# EAGLE design ICS40300-Silicon-Mic_Rev-C (EAGLE 8.2.1)
COMPANY: ADAFRUIT INDUSTRIES; DRAWN: KTOWN; REV: A
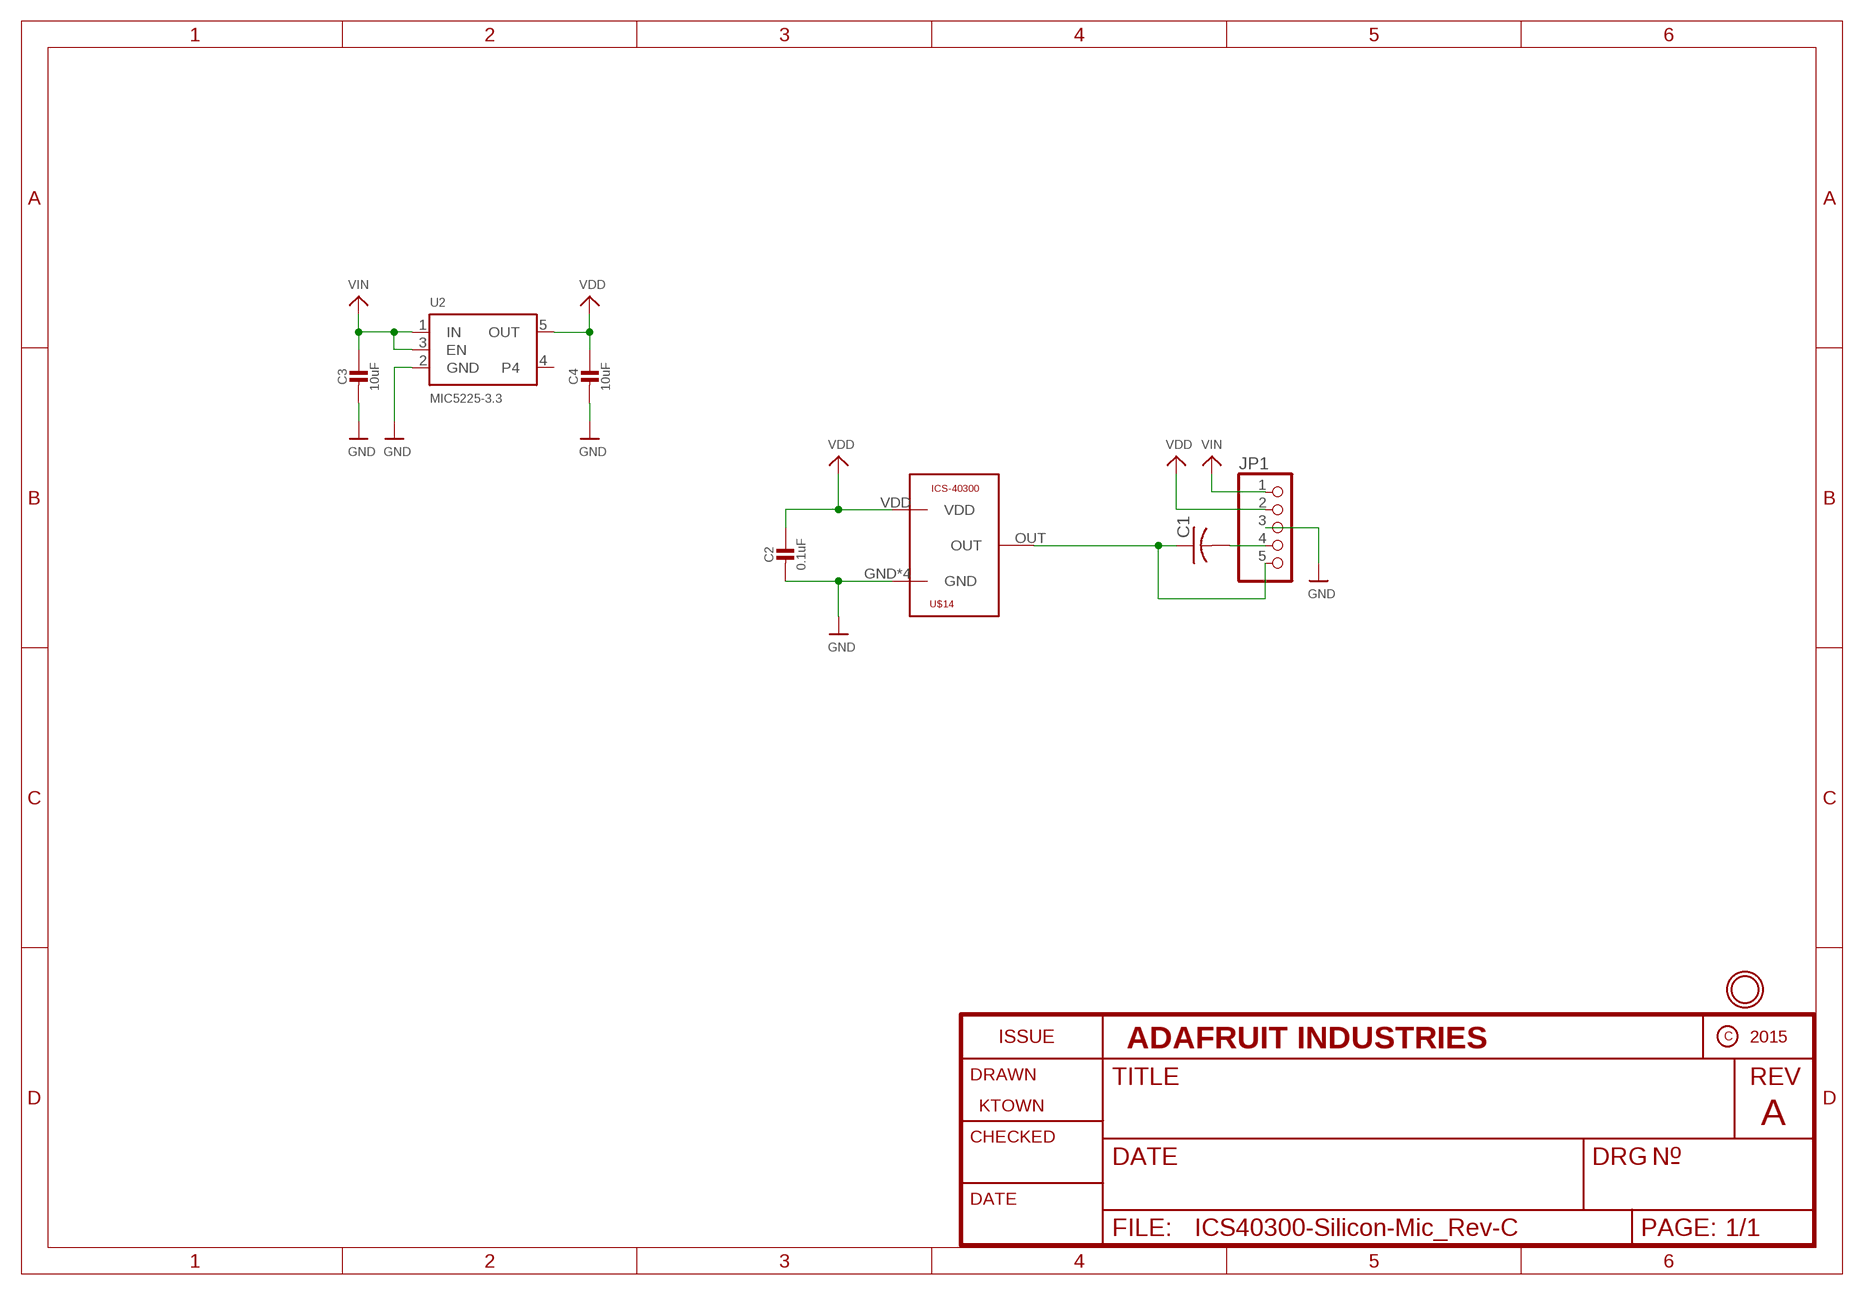
[diagram p0: schematic, sheet 1]

## Parts
C1  C-US  [CT7343]
C2  0.1uF  CAP_CERAMIC0805-NOOUTLINE  [0805-NO]
C3  10uF  CAP_CERAMIC0805-NOOUTLINE  [0805-NO]
C4  10uF  CAP_CERAMIC0805-NOOUTLINE  [0805-NO]
JP1  HEADER-1X576MIL  [1X05_ROUND_76]
U2  MIC5225-3.3  VREG_SOT23-5  [SOT23-5]
U$12  MOUNTINGHOLE2.5  [MOUNTINGHOLE_2.5_PLATED]
U$14  ICS-40300  [ICS-40300]

## Nets
GND: C2.2 C3.2 C4.2 JP1.3 U2.2(GND) U$14.GND U$14.GND1(GND) U$14.GND2(GND) U$14.GND3(GND)
N$1: C1.+ JP1.5 U$14.OUT
N$2: C1.- JP1.4
VDD: C2.1 C4.1 JP1.2 U2.5(OUT) U$14.VDD
VIN: C3.1 JP1.1 U2.1(IN) U2.3(EN)
Unconnected: U2.4

## Library data of the parts
C1 = adafruit:C-US: CAPACITOR, American symbol
C2-C4 = microbuilder:CAP_CERAMIC: Ceramic Capacitors For new designs, use the packages preceded by an '_' character since they are more reliable: The following footprints should be used on most boards: _0402 - Standard footprint for regular board layouts _0603 - Standard footprint for regular board layouts _0805 - Standard footprint for regular board layouts _1206 - Standard footprint for regular board layouts For extremely tight-pitch boards where space is at a premium, the following 'micro-pitch' footprints can be used (smaller pads, no silkscreen outline, etc.): _0402MP - Micro-pitch footprint for very dense/compact boards _0603MP - Micro-pitch footprint for very dense/compact boards _0805MP - Micro-pitch footprint for very dense/compact boards _1206MP - Micro-pitch footprint for very dense/compact boards
JP1 = microbuilder:HEADER-1X5: PIN HEADER
U2 = microbuilder:VREG_SOT23-5: SOT23-5 Fixed Voltage Regulators Part Current Out V Out V In V Dropout θJA (°C/W) TJ (°C) Digikey Part No. ADP121 150mA 3.3V 3.4-5.5V 0.09V @ 150mA -- -- ADP121-AUJZ33R7CT-ND ADP121 150mA 3.0V 3.1-5.5V 0.09V @ 150mA -- -- ADP121-AUJZ30R7CT-ND ADP122 300mA 3.3V 3.4-5.5V 0.085V @ 300mA -- -- ADP122AUJZ-3.3-R7CT-ND ADP1712 300mA 3.3V 3.5-5.5V 0.17V @ 300mA -- -- ADP1712AUJZ-3.3-R7TR-ND AP7311 (Low Cost) 150mA 3.3V 3.5-6V 0.15V @ 150mA -- -- AP7311-33WG-7DICT-ND LD39015M18R 150mA 1.8V 1.9V-5.5V 0.08V @ 100mA -- -- 497-6977-1-ND LP2985A-33DBVR 150mA 3.3V 3.3-16V 0.28V @ 150mA 206 150 296-18479-1-ND MCP1824T-3302E/OT 300mA 3.3V 3.5V-6V 0.2V @ 300mA -- -- MCP1824T-3302E/OTCT-ND MIC5205-2.5YM5 TR 150mA 2.5V 2.7-16V 0.165V @ 150mA -- -- 576-1257-2-ND MIC5205-3.0YM5 TR 150mA 3.0V 3.2V-16V 0.165V @ 150mA -- -- 576-1258-2-ND MIC5205-3.3YM5 TR 150mA 3.3V 3.5V-16V 0.165V @ 150mA -- -- 576-1259-2-ND TPS780330220 150mA 3.3V+2.2V 3.6-5.5V 250mV Max -- -- 296-23332-1-ND TDA3663/N1,135 100mA 3.3V 3.5-45V 0.18V @ 50mA -- -- 568-5343-1-ND Max operating temp can be calculated using θJA, TJ (max junction temperature), and power in watts. Set the "Maximum Ambient Temperature" until it reaches TJ ("Max Junction Temperature"), which is the absolute limit for safe use of the regulator: Heat Sink Temperature Calculator <http://www.daycounter.com/Calculators/Heat-Sink-Temperature-Calculator.phtml> For example, With 12V source into a 3.3V LP2985 and a 30mA load, we are dissipating (12V-3.3V) * 0.03A = 0.261W. With a θJA of 206 °C/W, a TJ of 150°C, and 261mW we can safely use the chip without a heat sink up to 75°C (=147.1°C Junction Temperature).
U$12 = microbuilder:MOUNTINGHOLE: Mounting Hole For #2 screws (0.086"/2.18mm width, 0.094"/2.4mm hole) use 2.5mm; BOM: EXCLUDE
U$14 = CMU-ArtFab:ICS-40300

## Board
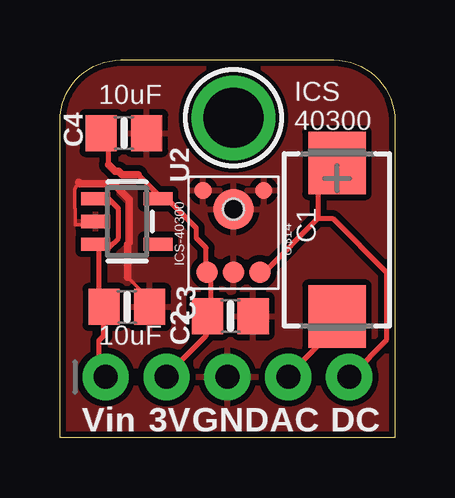
[diagram p1: board, top side]
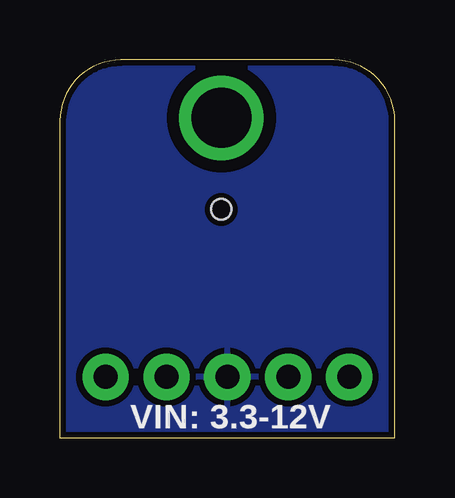
[diagram p2: board, bottom side, seen from below]

Size 13.97 x 15.75 mm. Coordinates in mm from the lower left corner, seen from the top.
Outline: 0,0 0,13.21 arc-90 2.54,15.75 11.43,15.75 arc-90 13.97,13.21 13.97,0 0,0
Copper layers (1*16): Top 0.035mm / dielectric 1.5mm / Bottom 0.035mm
Design rules "adafruit": minimum track width 8mil, minimum drill 15.5mil, track to track 8mil, track to pad 8mil, pad to pad 8mil, via to via 8mil, smd to smd 8mil, copper to edge 10mil, drill to drill 8mil, minimum pad ring 10mil, minimum via ring 8mil, stop-mask expansion 2mil, vias tented up to drill 20mil, thermal gap 10mil

### Footprints (pad centres in the part's own frame; a part is rotated, then mirrored left to right if it is on the bottom)
CT7343 = smd 2.6 x 2.4: + 3.2,0; - -3.2,0
0805-NO = smd 1.3 x 1.5: 1 -0.95,0; 2 0.95,0
1X05_ROUND_76 = drill 1 pad 1.93: 1 -5.08,0; 2 -2.54,0; 3 0,0; 4 2.54,0; 5 5.08,0
SOT23-5 = smd 0.55 x 1.2: 1 -0.95,-1.3; 2 0,-1.3; 3 0.95,-1.3; 4 0.95,1.3; 5 -0.95,1.3
MOUNTINGHOLE_2.5_PLATED = drill 2.5 pad 3.2: P$1 0,0
ICS-40300 = smd 0.9 x 0.9: GND -2.62,0; OUT -2.62,-1.1; VDD -2.62,1.1 | smd 0.7 x 0.7: GND1 0.79,1.27; GND2 0.79,-1.27 | smd 1.68 x 1.68: GND3 0,0 | hole 0.85: 0,0

### Placement (x,y rotation side)
C1  11.56,8.26 90 top
C2  7.11,5.08 0 top
C3  2.79,5.46 0 top
C4  2.67,12.7 0 top
JP1  6.99,2.54 0 top
U2  2.79,9.02 270 top
U$12  7.24,13.34 0 top
U$14  7.24,9.53 90 top

### Tracks (layer width: path | path; a pad name or v marks a point on that pad's centre or on a via)
GND
  Top 0.152: C3.2 3.74,5.78 2.82,6.71 | 0.78,10.65 0.61,10.36 0.61,9.58 0.64,9.56 0.64,8.89 1.37,8.89 U2.2
  Top 0.305: 2.82,6.71 2.82,8.07 2.9,8.14 2.9,9.94 2.24,10.6 0.83,10.6 0.78,10.65
  pour Top (isolate 0.254): 0,0 0,15.88 13.97,15.88 13.97,0
  pour Bottom (isolate 0.254): 0,0.25 0,16.38 13.97,16.38 13.97,0
N$1
  Top 0.203: 10.77,9.14 8.53,6.91 U$14.OUT | 10.77,9.14 10.77,10.77 11.38,11.38 C1.+ | 10.77,9.14 11.38,9.14 13.61,6.91 13.61,4.06 12.19,2.64 JP1.5
N$2
  Top 0.203: C1.- 11.38,4.88 11.38,4.47 9.55,2.64 JP1.4
VDD
  Top 0.203: 3.25,10.97 4.06,10.16 U2.5 4.27,9.96 4.47,9.96 5.69,8.74 5.69,8.33 6.1,7.92 6.1,6.91 U$14.VDD 6.3,6.71 6.3,5.08 C2.1 6.1,5.08 6.1,4.27 4.47,2.64 JP1.2 | 2.03,11.38 2.03,12.39 1.83,12.6 C4.1
  Top 0.305: 3.25,10.97 2.58,10.97 2.45,11.11 2.31,11.11 2.03,11.38
VIN
  Top 0.203: 1.63,7.92 1.63,5.69 1.83,5.49 C3.1 1.83,5.28 1.83,4.27 1.63,4.06 1.63,2.85 1.83,2.64 JP1.1 | 1.63,7.92 2.03,7.92 2.44,8.33 2.44,9.55 2.03,9.96 1.63,9.96 U2.1 | 1.63,7.92 U2.3

### Text on the board
tPlace: ICS / 40300 | Vin | 3V | GND | AC | DC
bPlace: VIN: 3.3-12V